# Altium schematic sheet USB Hub.SchDoc
size B; SheetNumber: 6; SheetTotal: 9
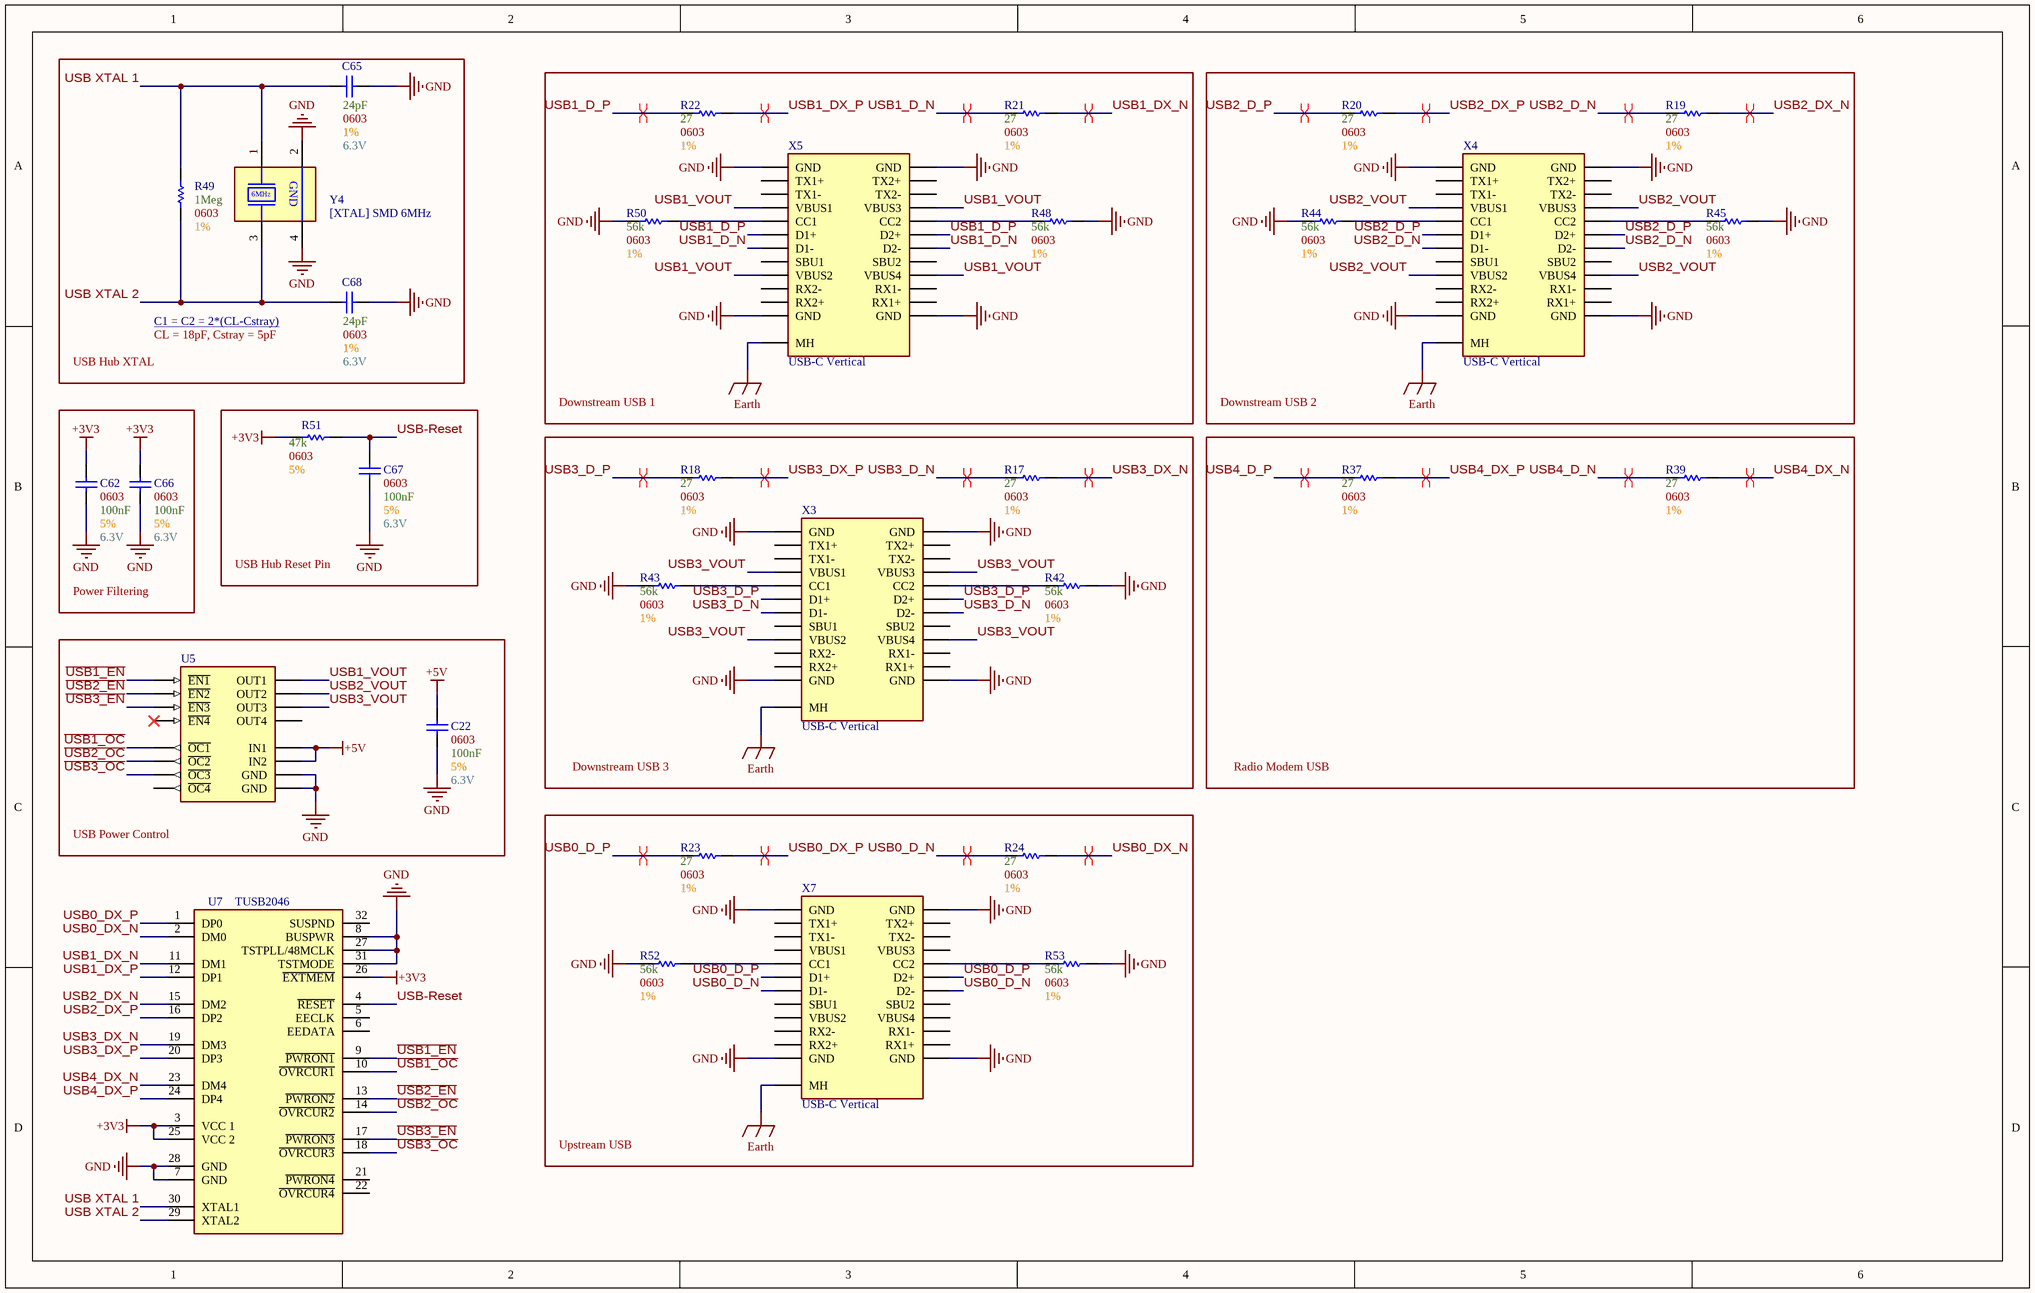
[diagram p0: USB Hub.SchDoc]

## Parts
C22  Size Package: 0603  Capacitance: 100nF  Voltage: 6.3V  Tolerance: 5%  [[Cap] SMD 0603]  (hidden comment: [Cap] SMD Nonpolarized)
C62  Size Package: 0603  Capacitance: 100nF  Voltage: 6.3V  Tolerance: 5%  [[Cap] SMD 0603]  (hidden comment: [Cap] SMD Nonpolarized)
C65  Tolerance: 1%  Size Package: 0603  Capacitance: 24pF  Voltage: 6.3V  [[Cap] SMD 0603]  (hidden comment: SMD Nonpolarized)
C66  Size Package: 0603  Capacitance: 100nF  Voltage: 6.3V  Tolerance: 5%  [[Cap] SMD 0603]  (hidden comment: [Cap] SMD Nonpolarized)
C67  Size Package: 0603  Capacitance: 100nF  Voltage: 6.3V  Tolerance: 5%  [[Cap] SMD 0603]  (hidden comment: [Cap] SMD Nonpolarized)
C68  Tolerance: 1%  Size Package: 0603  Capacitance: 24pF  Voltage: 6.3V  [[Cap] SMD 0603]  (hidden comment: SMD Nonpolarized)
R17  Tolerance: 1%  Resistance: 27  Size Package: 0603  [[Res] SMD 0603]  (hidden comment: [Res] SMD Resistor)
R18  Tolerance: 1%  Resistance: 27  Size Package: 0603  [[Res] SMD 0603]  (hidden comment: [Res] SMD Resistor)
R19  Tolerance: 1%  Resistance: 27  Size Package: 0603  [[Res] SMD 0603]  (hidden comment: [Res] SMD Resistor)
R20  Tolerance: 1%  Resistance: 27  Size Package: 0603  [[Res] SMD 0603]  (hidden comment: [Res] SMD Resistor)
R21  Tolerance: 1%  Resistance: 27  Size Package: 0603  [[Res] SMD 0603]  (hidden comment: [Res] SMD Resistor)
R22  Tolerance: 1%  Resistance: 27  Size Package: 0603  [[Res] SMD 0603]  (hidden comment: [Res] SMD Resistor)
R23  Tolerance: 1%  Resistance: 27  Size Package: 0603  [[Res] SMD 0603]  (hidden comment: [Res] SMD Resistor)
R24  Tolerance: 1%  Resistance: 27  Size Package: 0603  [[Res] SMD 0603]  (hidden comment: [Res] SMD Resistor)
R37  Tolerance: 1%  Resistance: 27  Size Package: 0603  [[Res] SMD 0603]  (hidden comment: [Res] SMD Resistor)
R39  Tolerance: 1%  Resistance: 27  Size Package: 0603  [[Res] SMD 0603]  (hidden comment: [Res] SMD Resistor)
R42  Tolerance: 1%  Resistance: 56k  Size Package: 0603  [[Res] SMD 0603]  (hidden comment: [Res] SMD Resistor)
R43  Tolerance: 1%  Resistance: 56k  Size Package: 0603  [[Res] SMD 0603]  (hidden comment: [Res] SMD Resistor)
R44  Tolerance: 1%  Resistance: 56k  Size Package: 0603  [[Res] SMD 0603]  (hidden comment: [Res] SMD Resistor)
R45  Tolerance: 1%  Resistance: 56k  Size Package: 0603  [[Res] SMD 0603]  (hidden comment: [Res] SMD Resistor)
R48  Tolerance: 1%  Resistance: 56k  Size Package: 0603  [[Res] SMD 0603]  (hidden comment: [Res] SMD Resistor)
R49  Tolerance: 1%  Resistance: 1Meg  Size Package: 0603  [[Res] SMD 0603]  (hidden comment: [Res] SMD Resistor)
R50  Tolerance: 1%  Resistance: 56k  Size Package: 0603  [[Res] SMD 0603]  (hidden comment: [Res] SMD Resistor)
R51  Tolerance: 5%  Resistance: 47k  Size Package: 0603  [[Res] SMD 0603]  (hidden comment: [Res] SMD Resistor)
R52  Tolerance: 1%  Resistance: 56k  Size Package: 0603  [[Res] SMD 0603]  (hidden comment: [Res] SMD Resistor)
R53  Tolerance: 1%  Resistance: 56k  Size Package: 0603  [[Res] SMD 0603]  (hidden comment: [Res] SMD Resistor)
U5  [IC] USB Hub Power Distribution  [[IC] USB Hub Power Distribution]  (value not drawn)
U7  TUSB2046  [[IC] USB Hub 4port (2)]
X3  USB-C Vertical  [[Port] USB-C Vertical]
X4  USB-C Vertical  [[Port] USB-C Vertical]
X5  USB-C Vertical  [[Port] USB-C Vertical]
X7  USB-C Vertical  [[Port] USB-C Vertical]
Y4  [XTAL] SMD 6MHz  [[XTAL] SMD 6MHz]

## Blocks framed on the sheet
Downstream USB 1: R21 R22 R48 R50 X5
Downstream USB 2: R19 R20 R44 R45 X4
Power Filtering: C62 C66
USB Hub Reset Pin: C67 R51
Downstream USB 3: R17 R18 R42 R43 X3
Radio Modem USB: R37 R39
USB Power Control: C22 U5
Upstream USB: R23 R24 R52 R53 X7

## Nets
+3V3: C62.2 C66.2 R51.1 U7.3(VCC_1) U7.25(VCC_2) U7.26(~{EXTMEM})
+5V: C22.2 U5.2(IN1) U5.6(IN2)
Earth: X3.MH X4.MH X5.MH X7.MH
GND: C22.1 C62.1 C65.2 C66.1 C67.1 C68.2 R42.2 R43.1 R44.1 R45.2 R48.2 R50.1 R52.1 R53.2 U5.1(GND) U5.5(GND) U7.7(GND) U7.8(BUSPWR) U7.27(TSTPLL/48MCLK) U7.28(GND) U7.31(TSTMODE) X3.A1(GND) X3.A12(GND) X3.B1(GND) X3.B12(GND) X4.A1(GND) X4.A12(GND) X4.B1(GND) X4.B12(GND) X5.A1(GND) X5.A12(GND) X5.B1(GND) X5.B12(GND) X7.A1(GND) X7.A12(GND) X7.B1(GND) X7.B12(GND) Y4.2(GND) Y4.4(GND)
~{USB1_EN}: U5.3(~{EN1}) U7.9(~{PWRON1})
~{USB1_OC}: U5.16(~{OC1}) U7.10(~{OVRCUR1})
~{USB2_EN}: U5.4(~{EN2}) U7.13(~{PWRON2})
~{USB2_OC}: U5.13(~{OC2}) U7.14(~{OVRCUR2})
~{USB3_EN}: U5.7(~{EN3}) U7.17(~{PWRON3})
~{USB3_OC}: U5.12(~{OC3}) U7.18(~{OVRCUR3})
USB0_D_N: R24.1 X7.A7(D1-) X7.B7(D2-)
USB0_D_P: R23.1 X7.A6(D1+) X7.B6(D2+)
USB0_DX_N: R24.2 U7.2(DM0)
USB0_DX_P: R23.2 U7.1(DP0)
USB1_D_N: R21.1 X5.A7(D1-) X5.B7(D2-)
USB1_D_P: R22.1 X5.A6(D1+) X5.B6(D2+)
USB1_DX_N: R21.2 U7.11(DM1)
USB1_DX_P: R22.2 U7.12(DP1)
USB1_VOUT: U5.15(OUT1) X5.A4(VBUS1) X5.A9(VBUS2) X5.B4(VBUS3) X5.B9(VBUS4)
USB2_D_N: R19.1 X4.A7(D1-) X4.B7(D2-)
USB2_D_P: R20.1 X4.A6(D1+) X4.B6(D2+)
USB2_DX_N: R19.2 U7.15(DM2)
USB2_DX_P: R20.2 U7.16(DP2)
USB2_VOUT: U5.14(OUT2) X4.A4(VBUS1) X4.A9(VBUS2) X4.B4(VBUS3) X4.B9(VBUS4)
USB3_D_N: R17.1 X3.A7(D1-) X3.B7(D2-)
USB3_D_P: R18.1 X3.A6(D1+) X3.B6(D2+)
USB3_DX_N: R17.2 U7.19(DM3)
USB3_DX_P: R18.2 U7.20(DP3)
USB3_VOUT: U5.11(OUT3) X3.A4(VBUS1) X3.A9(VBUS2) X3.B4(VBUS3) X3.B9(VBUS4)
USB4_D_N: R39.1
USB4_D_P: R37.1
USB4_DX_N: R39.2 U7.23(DM4)
USB4_DX_P: R37.2 U7.24(DP4)
USB XTAL 1: C65.1 R49.2 U7.30(XTAL1) Y4.1(XTAL1)
USB XTAL 2: C68.1 R49.1 U7.29(XTAL2) Y4.3(XTAL2)
USB-Reset: C67.2 R51.2 U7.4(~{RESET})
NetR42_1: R42.1 X3.B5(CC2)
NetR43_2: R43.2 X3.A5(CC1)
NetR44_2: R44.2 X4.A5(CC1)
NetR45_1: R45.1 X4.B5(CC2)
NetR48_1: R48.1 X5.B5(CC2)
NetR50_2: R50.2 X5.A5(CC1)
NetR52_2: R52.2 X7.A5(CC1)
NetR53_1: R53.1 X7.B5(CC2)

Not connected (* = marked no-connect by the designer): U5 8(~{EN4})* 9(~{OC4}) 10(OUT4); U7 5(EECLK) 6(EEDATA) 21(~{PWRON4}) 22(~{OVRCUR4}) 32(SUSPND); X3 A2(TX1+) A3(TX1-) A8(SBU1) A10(RX2-) A11(RX2+) B2(TX2+) B3(TX2-) B8(SBU2) B10(RX1-) B11(RX1+); X4 A2(TX1+) A3(TX1-) A8(SBU1) A10(RX2-) A11(RX2+) B2(TX2+) B3(TX2-) B8(SBU2) B10(RX1-) B11(RX1+); X5 A2(TX1+) A3(TX1-) A8(SBU1) A10(RX2-) A11(RX2+) B2(TX2+) B3(TX2-) B8(SBU2) B10(RX1-) B11(RX1+); X7 A2(TX1+) A3(TX1-) A4(VBUS1) A8(SBU1) A9(VBUS2) A10(RX2-) A11(RX2+) B2(TX2+) B3(TX2-) B4(VBUS3) B8(SBU2) B9(VBUS4) B10(RX1-) B11(RX1+)

## Layout directives
differential pair; differential pair class USB_Pairs: USB0_D_N, USB0_D_P, USB0_DX_N, USB0_DX_P, USB1_D_N, USB1_D_P, USB1_DX_N, USB1_DX_P, USB2_D_N, USB2_D_P, USB2_DX_N, USB2_DX_P, USB3_D_N, USB3_D_P, USB3_DX_N, USB3_DX_P, USB4_D_N, USB4_D_P, USB4_DX_N, USB4_DX_P

## Notes on the sheet
- USB Hub XTAL
- (near C68) C1 = C2 = 2*(CL-Cstray) <https://microchip.my.site.com/s/article/Calculating-crystal-load-capacitor>
- CL = 18pF, Cstray = 5pF
- (in symbol [XTAL] SMD 6MHz) 6MHz

## Library data of the parts
C65 C68 = [Cap] SMD Nonpolarized: Supplier 1: DigiKey; Supplier Part Number 1: 490-GCM1885C2A240JA16DCT-ND
R17-R24 R37 R39 R42-R45 R48-R53 = [Res] SMD Resistor: Generic; Supplier 1: DigiKey
  R17-R24 R37 R39: Supplier Part Number 1: 749-1631-1-ND
  R42-R45 R48 R50 R52 R53: Supplier Part Number 1: A129709CT-ND
  R49: Supplier Part Number 1: 311-1.00MHRDKR-ND
  R51: Supplier Part Number 1: 311-4.70KHRDKR-ND
U7 = [IC] USB Hub 4port (2): TUSB2046BVFR; Supplier 1: DigiKey; Supplier Part Number 1: 296-27131-1-ND
X3-X5 X7 = [Port] USB Type-C Vertical: Supplier 1: DigiKey; Supplier Part Number 1: 277-1332646CT-ND
Y4 = [XTAL] SMD 6MHz: ECS-060-18-20BM-JEN-TR; Supplier 1: DigiKey; Supplier Part Number 1: XC2349CT-ND
C22 C62 C66 C67 = [Cap] SMD Nonpolarized: Supplier 1: DigiKey; Supplier Part Number 1: 311-1088-6-ND
U5 = [IC] USB Hub Power Distribution: Supplier 1: DigiKey; Supplier Part Number 1: 296-26909-1-ND